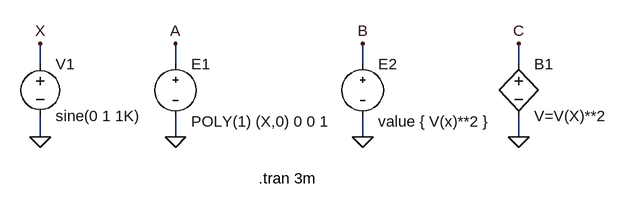
[diagram p0: schematic Epoly.asc]
Epoly.asc, the LTspice schematic file:
Version 4
SHEET 1 952 680
WIRE 64 224 64 192
WIRE 64 336 64 304
WIRE 272 224 272 192
WIRE 272 336 272 304
WIRE 560 224 560 192
WIRE 560 336 560 304
WIRE 800 224 800 192
WIRE 800 336 800 304
FLAG 64 336 0
FLAG 272 336 0
FLAG 64 192 X
FLAG 560 336 0
FLAG 272 192 A
FLAG 560 192 B
FLAG 800 336 0
FLAG 800 192 C
SYMBOL misc\\Epoly 272 208 R0
SYMATTR InstName E1
SYMATTR Value POLY(1) (X,0) 0 0 1
SYMBOL voltage 64 208 R0
SYMATTR InstName V1
SYMATTR Value sine(0 1 1K)
SYMBOL misc\\Epoly 560 208 R0
SYMATTR InstName E2
SYMATTR Value value { V(x)**2 }
SYMBOL bv 800 208 R0
SYMATTR InstName B1
SYMATTR Value V=V(X)**2
TEXT 400 400 Left 0 !.tran 3m

The netlist it stands for:
* Epoly.asc
E1 A 0 POLY(1) (X,0) 0 0 1
V1 X 0 sine(0 1 1K)
E2 B 0 value { V(x)**2 }
B1 C 0 V=V(X)**2
.tran 3m
.backanno
.end